# EAGLE design ESPNTPServer (EAGLE 9.0.1)
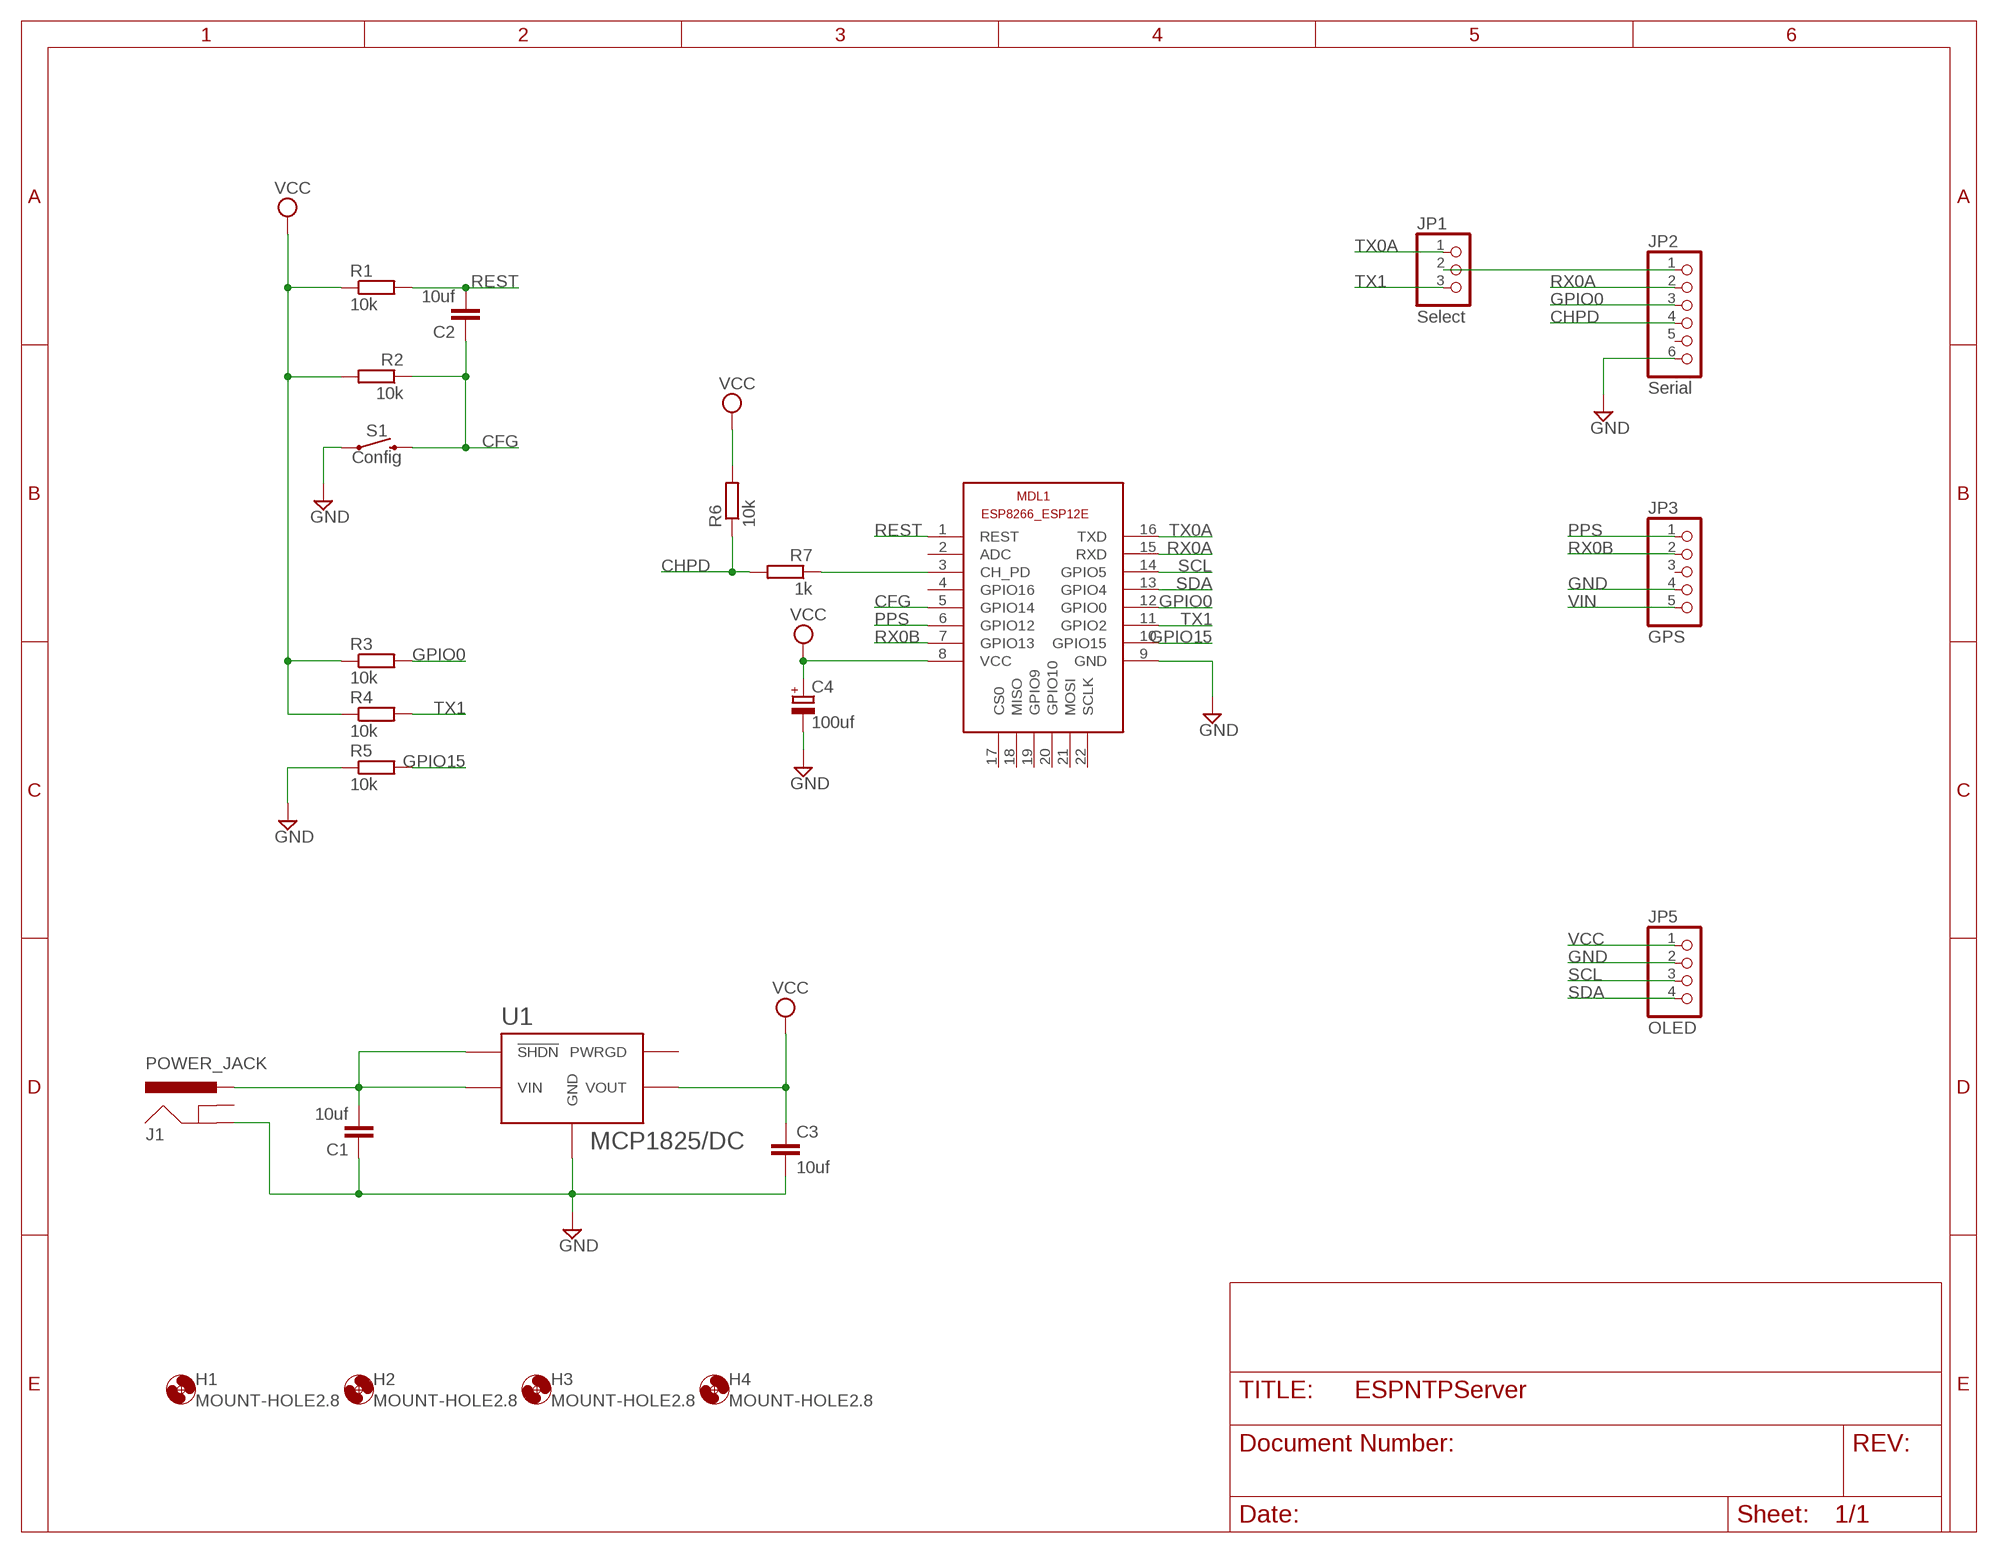
[diagram p0: schematic, sheet 1]

## Parts
C1  10uf  C-EU050-025X075  [C050-025X075]
C2  10uf  C-EU050-025X075  [C050-025X075]
C3  10uf  C-EU050-025X075  [C050-025X075]
C4  100uf  CPOL-EUE2.5-5  [E2,5-5]
H1  MOUNT-HOLE2.8  [2,8]
H2  MOUNT-HOLE2.8  [2,8]
H3  MOUNT-HOLE2.8  [2,8]
H4  MOUNT-HOLE2.8  [2,8]
J1  POWER_JACK  [POWER_JACK_PTH]
JP1  Select  PINHD-1X3  [1X03]
JP2  Serial  PINHD-1X6  [1X06]
JP3  GPS  PINHD-1X5  [1X05]
JP5  OLED  PINHD-1X4  [1X04]
MDL1  ESP8266-12F  ESP8266-12EESP8266-ESP12E  [ESP8266-ESP12E]
R1  10k  R-EU_0204/2V  [0204V]
R2  10k  R-EU_0204/2V  [0204V]
R3  10k  R-EU_0204/2V  [0204V]
R4  10k  R-EU_0204/2V  [0204V]
R5  10k  R-EU_0204/2V  [0204V]
R6  10k  R-EU_0204/2V  [0204V]
R7  1k  R-EU_0204/2V  [0204V]
S1  Config  MOMENTARY-SWITCH-SPST-PTH-6.0MM  [TACTILE_SWITCH_PTH_6.0MM]
U1  MCP1825/DC  [SOT-223-5]

## Nets
CFG: C2.1 MDL1.5(GPIO14) R2.1 S1.3
CHPD: JP2.4 R6.1 R7.2
GND [power]: C1.1 C3.2 C4.- J1.GND JP2.6 JP3.4 JP5.2 MDL1.9(GND) R5.1 S1.1 U1.P$3(GND) U1.P$6(GND)
GPIO0: JP2.3 MDL1.12(GPIO0) R3.2
GPIO15: MDL1.10(GPIO15) R5.2
N$1: JP1.2 JP2.1
N$4: MDL1.3(CH_PD) R7.1
PPS: JP3.1 MDL1.6(GPIO12)
REST: C2.2 MDL1.1(REST) R1.2
RX0A: JP2.2 MDL1.15(RXD)
RX0B: JP3.2 MDL1.7(GPIO13)
SCL: JP5.3 MDL1.14(GPIO5)
SDA: JP5.4 MDL1.13(GPIO4)
TX0A: JP1.1 MDL1.16(TXD)
TX1: JP1.3 MDL1.11(GPIO2) R4.2
VCC [power]: C3.1 C4.+ JP5.1 MDL1.8(VCC) R1.1 R2.2 R3.1 R4.1 R6.2 U1.P$4(VOUT)
VIN [power]: C1.2 J1.PWR JP3.5 U1.P$1(!SHDN) U1.P$2(VIN)
Unconnected: J1.GNDBREAK JP2.5 JP3.3 MDL1.2(ADC) MDL1.4(GPIO16) MDL1.17(CS0) MDL1.18(MISO) MDL1.19(GPIO9) MDL1.20(GPIO10) MDL1.21(MOSI) MDL1.22(SCLK) U1.P$5(PWRGD)

## Library data of the parts
C1-C3 = rcl:C-EU: CAPACITOR, European symbol; SPICEPREFIX: C
C4 = rcl:CPOL-EU: POLARIZED CAPACITOR, European symbol; SPICEPREFIX: C
H1-H4 = holes:MOUNT-HOLE: MOUNTING HOLE with drill center marker
J1 = ESPNTPServer:POWER_JACK: Power Jack Connector This is the standard 5.5mm barrel jack for power. The PTH is the most common, proven, reliable, footprint. The Slot footprint only works if the mill layer is transmitted to the PCB fab house so be warned. Here are the connectors we sell at SparkFun: DC Barrel Power Jack/Connector <https://www.sparkfun.com/products/119> (PRT-00119) DC Barrel Power Jack/Connector (SMD) <https://www.sparkfun.com/products/12748> (PRT-12748) DC Barrel Jack Adapter - Breadboard Compatible <https://www.sparkfun.com/products/10811> (PRT-10811) It is used on this SparkFun product (and many, many others): SparkFun RedBoard - Programmed with Arduino <https://www.sparkfun.com/products/12757> (DEV-12757) Also, if you need a mating power supply or connector, please check these out: Wall Adapter Power Supply - 9VDC 650mA <https://www.sparkfun.com/products/298> (TOL-00298) DC Barrel Jack Adapter - Male <https://www.sparkfun.com/products/10287> (PRT-10287); PROD_ID: CONN-08197
JP1 = pinhead:PINHD-1X3: PIN HEADER
JP2 = pinhead:PINHD-1X6: PIN HEADER
JP3 = pinhead:PINHD-1X5: PIN HEADER
JP5 = pinhead:PINHD-1X4: PIN HEADER
MDL1 = ESPNTPServer:ESP8266-12E: ESP8266-12E with additional I/O and GPIO04/05 corrected The author cannot warrant that this library is free from error or will meet your specific requirements. Created by PuceBaboon.com. Komagane, Nagano, JAPAN
R1-R7 = rcl:R-EU_: RESISTOR, European symbol; SPICEPREFIX: R
S1 = ESPNTPServer:MOMENTARY-SWITCH-SPST: Momentary Switch (Pushbutton) - SPST Normally-open (NO) SPST momentary switches (buttons, pushbuttons). Variants PTH-12MM - 12mm square, through-hole Momentary Pushbutton Switch - 12mm Square <https://www.sparkfun.com/products/9190> (COM-09190) PTH-6.0MM, PTH-6.0MM-KIT - 6.0mm square, through-hole Mini Pushbutton Switch <https://www.sparkfun.com/products/97> (COM-00097) KIT package intended for soldering kit's - only one side of pads' copper is exposed. PTH-RIGHT-ANGLE-KIT - Right-angle, through-hole Right Angle Tactile Button <https://www.sparkfun.com/products/10791> - Used on SparkFun BigTime Watch Kit <https://www.sparkfun.com/products/11734> SMD-12MM - 12mm square, surface-mount Tactile Button - SMD (12mm) <https://www.sparkfun.com/products/12993> (COM-12993) Used on SparkFun PicoBoard <https://www.sparkfun.com/products/11888> SMD-4.5MM - 4.5mm Square Trackball Switch Used on SparkFun Blackberry Trackballer Breakout <https://www.sparkfun.com/products/13169> SMD-4.6MMX2.8MM - 4.60mm x 2.80mm, surface mount Used on SparkFun SAMD21 Mini Breakout <https://www.sparkfun.com/products/13664> SMD-5.2MM, SMD-5.2-REDUNDANT - 5.2mm square, surface-mount Mini Pushbutton Switch - SMD <https://www.sparkfun.com/products/8720> (COM-08720) Used on Arduino Pro Mini <https://www.sparkfun.com/products/11114> REDUNDANT package connects both switch circuits together SMD-6.0X3.5MM - 6.0 x 3.5mm, surface mount Momentary Reset Switch SMD <https://www.sparkfun.com/products/8229> (COM-08229) SMD-6.2MM-TALL - 6.2mm square, surface mount Tactile Button - SMD (6mm) <https://www.sparkfun.com/products/12992> Used on SparkFun Digital Sandbox <https://www.sparkfun.com/products/12651> SMD-RIGHT-ANGLE - Right-angle, surface mount Used on SparkFun Block for Intel® Edison - Arduino <https://www.sparkfun.com/products/13036>; PROD_ID: SWCH-08441; SF_SKU: COM-00097
U1 = MCP1825:MCP1825/DC

## Net classes
1 power: width 0.508 mm

## Board
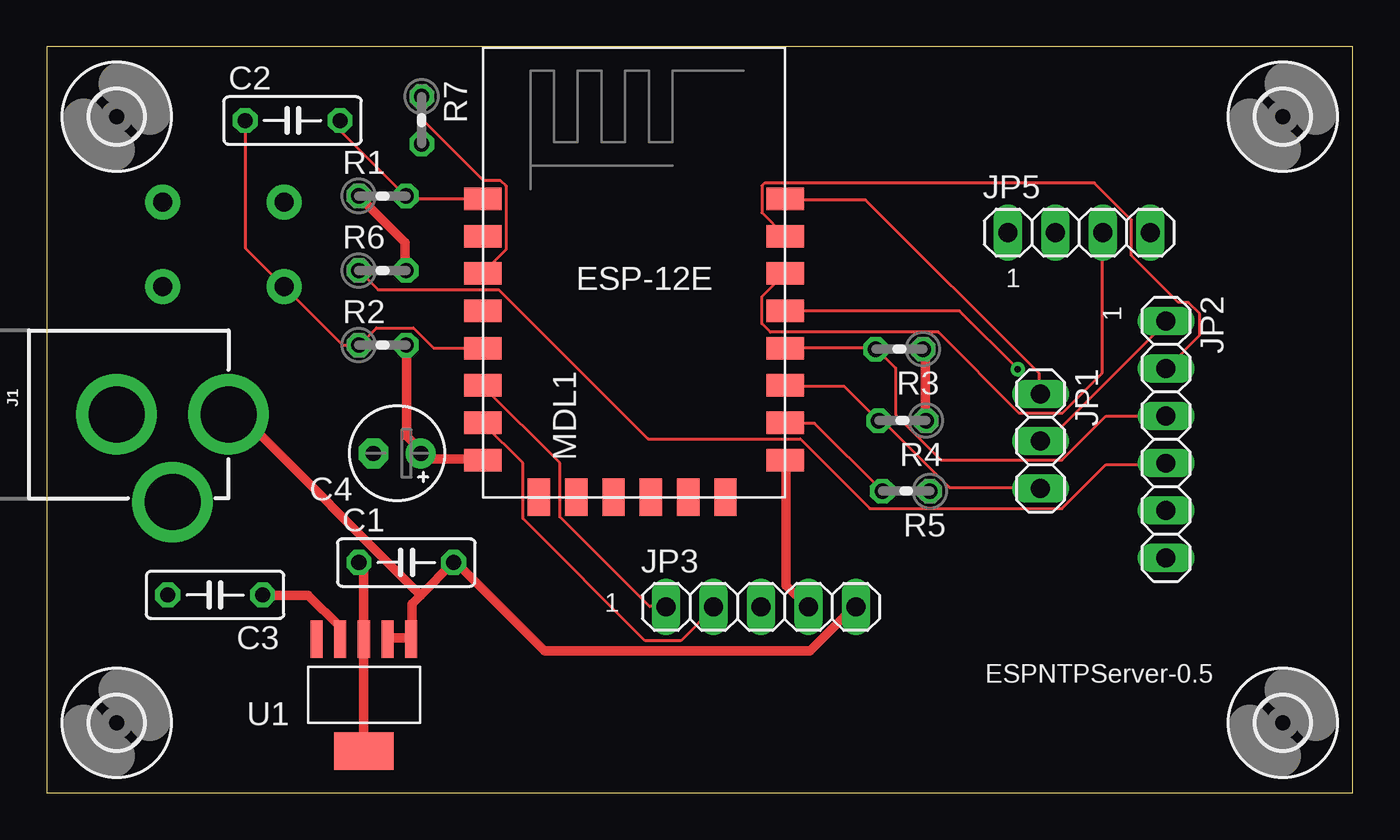
[diagram p1: board, top side]
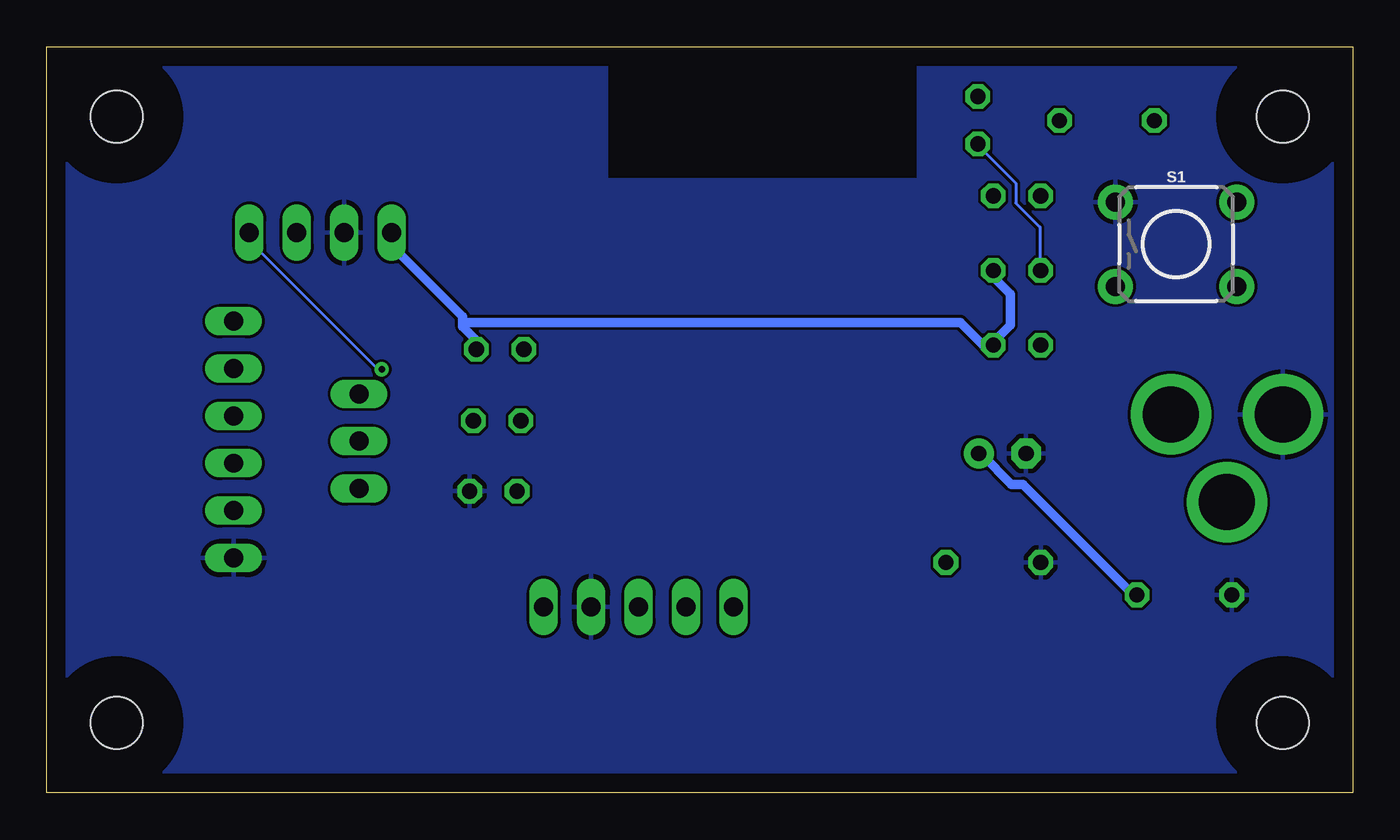
[diagram p2: board, bottom side, seen from below]

Size 70 x 40 mm. Coordinates in mm from the lower left corner, seen from the top.
Outline: 0,0 70,0 70,40 0,40 0,0
Copper layers (1*16): Top 0.035mm / dielectric 1.5mm / Bottom 0.035mm
Design rules "default": minimum track width 6mil, minimum drill 0.35mm, track to track 6mil, track to pad 6mil, pad to pad 6mil, via to via 6mil, smd to smd 6mil, copper to edge 40mil, drill to drill 6mil, minimum pad ring 10mil, minimum via ring 8mil, stop-mask expansion 4mil, vias tented up to drill 0mil, thermal gap 10mil

### Footprints (pad centres in the part's own frame; a part is rotated, then mirrored left to right if it is on the bottom)
C050-025X075 = drill 0.813 octagon: 1 -2.54,0; 2 2.54,0
E2,5-5 = drill 0.813 pad 1.6: + -1.27,0 | drill 0.813 pad 1.6 octagon: - 1.27,0
2,8 = hole 2.8: 0,0
POWER_JACK_PTH = drill 2.997 pad 4.318: GND 0,7.7; GNDBREAK 4.7,10.7; PWR 0,13.7
1X03 = drill 1.016 long: 1 -2.54,0; 2 0,0; 3 2.54,0
1X06 = drill 1.016 long: 1 -6.35,0; 2 -3.81,0; 3 -1.27,0; 4 1.27,0; 5 3.81,0; 6 6.35,0
1X05 = drill 1.016 long: 1 -5.08,0; 2 -2.54,0; 3 0,0; 4 2.54,0; 5 5.08,0
1X04 = drill 1.016 long: 1 -3.81,0; 2 -1.27,0; 3 1.27,0; 4 3.81,0
ESP8266-ESP12E = smd 2 x 1.2: 1 -7.62,5.84; 2 -7.62,3.84; 3 -7.62,1.84; 4 -7.62,-0.16; 5 -7.62,-2.16; 6 -7.62,-4.16; 7 -7.62,-6.16; 8 -7.62,-8.16; 9 8.58,-8.16; 10 8.58,-6.16; 11 8.58,-4.16; 12 8.58,-2.16; 13 8.58,-0.16; 14 8.58,1.84; 15 8.58,3.84; 16 8.58,5.84 | smd 1.2 x 2: 17 -4.62,-10.16; 18 -2.62,-10.16; 19 -0.62,-10.16; 20 1.38,-10.16; 21 3.38,-10.16; 22 5.38,-10.16
0204V = drill 0.813 octagon: 1 -1.27,0; 2 1.27,0
TACTILE_SWITCH_PTH_6.0MM = drill 1.016 pad 1.88: 1 -3.251,2.261; 2 3.251,2.261; 3 -3.251,-2.261; 4 3.251,-2.261
SOT-223-5 = smd 0.65 x 2: P$1 -2.54,-2; P$2 -1.27,-2; P$3 0,-2; P$4 1.27,-2; P$5 2.54,-2 | smd 3.2 x 2: P$6 0,4

### Placement (x,y rotation side)
C1  19.27,12.35 0 top
C2  13.18,36.04 0 top
C3  9.03,10.61 180 top
C4  18.78,18.2 180 top
H1  3.75,36.25 0 top
H2  3.75,3.75 0 top
H3  66.25,3.75 0 top
H4  66.25,36.25 0 top
J1  -3.95,20.29 270 top
JP1  53.26,18.85 270 top
JP2  59.98,18.94 270 top
JP3  38.28,9.97 0 top
JP5  55.33,30.03 0 top
MDL1  31,26 0 top
R1  18,32 0 top
R2  18,24 0 top
R3  45.7,23.78 180 top
R4  45.86,19.95 180 top
R5  46.06,16.17 180 top
R6  18,28 0 top
R7  20.1,36.06 270 top
S1  9.47,29.41 0 bottom
U1  17,6.25 180 top

### Tracks (layer width: path | path; a pad name or v marks a point on that pad's centre or on a via)
CFG
  Top 0.152: MDL1.5 23.32,23.85 20.73,23.85 19.66,24.92 17.68,24.92 16.76,24 R2.1 16.69,24 15.85,24 12.72,27.13 S1.3 12.65,27.2 10.67,29.18 10.67,35.97 C2.1
CHPD
  Top 0.152: JP2.4 59.97,17.6 56.77,17.6 54.41,15.24 44.12,15.24 40.39,18.97 32.23,18.97 24.23,26.98 17.75,26.98 16.76,27.96 R6.1
  Bottom 0.152: R6.1 16.76,28.04 16.76,30.33 18.06,31.62 18.06,32.69 20.12,34.75 R7.2
GND
  Top 0.508: C1.1 16.76,12.34 16.99,12.12 16.99,8.31 U1.P$3 16.99,8 16.99,2.29 U1.P$6 | MDL1.9 39.62,17.83 39.62,11.12 40.77,9.98 JP3.4
  pour Bottom: 0,40 70,40 70,0 0,0
GPIO0
  Top 0.152: MDL1.12 39.62,23.85 44.42,23.85 R3.2 44.5,23.77 45.49,22.78 45.49,20.27 47.93,17.83 54.41,17.83 56.77,20.19 59.97,20.19 JP2.3
GPIO15
  Top 0.152: R5.2 41.15,19.81 39.62,19.81 MDL1.10
N$1
  Top 0.152: JP1.2 53.26,18.9 53.65,18.9 59.97,25.22 JP2.1
N$4
  Top 0.152: MDL1.3 23.39,27.89 24.61,29.11 24.61,32.54 24.31,32.84 23.39,32.84 20.12,36.12 20.12,37.26 R7.1
PPS
  Top 0.152: MDL1.6 23.39,21.79 27.51,17.68 27.51,14.78 32.31,9.98 33.15,9.98 JP3.1
REST
  Top 0.152: MDL1.1 23.32,31.85 19.36,31.85 19.28,31.93 R1.2 19.2,32 15.77,35.43 15.77,35.97 C2.2
RX0A
  Top 0.152: MDL1.15 39.55,29.87 38.33,31.09 38.33,32.54 38.48,32.69 56.16,32.69 58.14,30.71 58.14,28.8 60.66,26.29 61.19,26.29 61.8,25.68 61.8,24.54 60.05,22.78 JP2.2
RX0B
  Top 0.152: MDL1.7 23.39,19.81 25.53,17.68 25.53,14.71 32.08,8.15 33.98,8.15 35.74,9.91 JP3.2
SCL
  Top 0.152: MDL1.14 39.55,27.81 38.33,26.59 38.33,25.15 38.79,24.69 47.78,24.69 52.12,20.34 54.41,20.34 56.54,22.48 56.54,30.02 JP5.3
SDA  (via drill 0.35)
  Top 0.152: v52.05,22.71 48.92,25.83 39.62,25.83 MDL1.13
  Bottom 0.152: v52.05,22.71 52.27,22.71 59.13,29.57 JP5.4
TX0A
  Top 0.152: MDL1.16 39.62,31.77 43.89,31.77 53.19,22.48 53.19,21.41 JP1.1
TX1
  Top 0.152: MDL1.11 39.62,21.79 42.75,21.79 44.58,19.96 R4.2 44.65,19.89 44.88,19.89 48.39,16.38 53.19,16.38 JP1.3
VCC
  Top 0.508: R4.1 47.09,19.96 47.09,23.7 47.02,23.77 R3.1 | R6.2 19.2,28.04 19.2,29.49 16.76,31.93 R1.1 | U1.P$4 15.7,8.31 15.7,8.91 14.02,10.59 11.58,10.59 C3.1 | MDL1.8 23.32,17.91 20.34,17.91 20.12,18.14 C4.+ 19.96,18.44 19.28,19.13 19.28,23.93 R2.2
  Bottom 0.508: 47.7,25.22 47.7,24.99 46.94,24.23 46.94,23.85 R3.1 | 47.7,25.22 47.7,25.53 51.51,29.34 JP5.1 | C3.1 11.58,10.67 11.81,10.67 17.68,16.54 18.29,16.54 19.89,18.14 20.04,18.14 C4.+ | R6.2 19.2,27.96 19.2,27.58 18.36,26.75 18.36,25.07 19.05,24.38 19.05,24.16 19.2,24 R2.2 19.51,23.93 19.74,23.93 21.03,25.22 47.7,25.22
VIN
  Top 0.508: U1.P$2 18.29,8.31 19.51,8.31 U1.P$1 19.58,8.53 19.58,10.13 20.04,10.59 | 20.04,10.59 21.79,12.34 C1.2 22.02,12.27 26.67,7.62 40.92,7.62 43.2,9.91 43.36,9.91 JP3.5 | 20.04,10.59 10.36,20.27 9.75,20.27 J1.PWR

### Text on the board
tNames: 1 | 1 | 1 | ESPNTPServer-0.5